# EAGLE design exp20 (EAGLE 6.5.0)
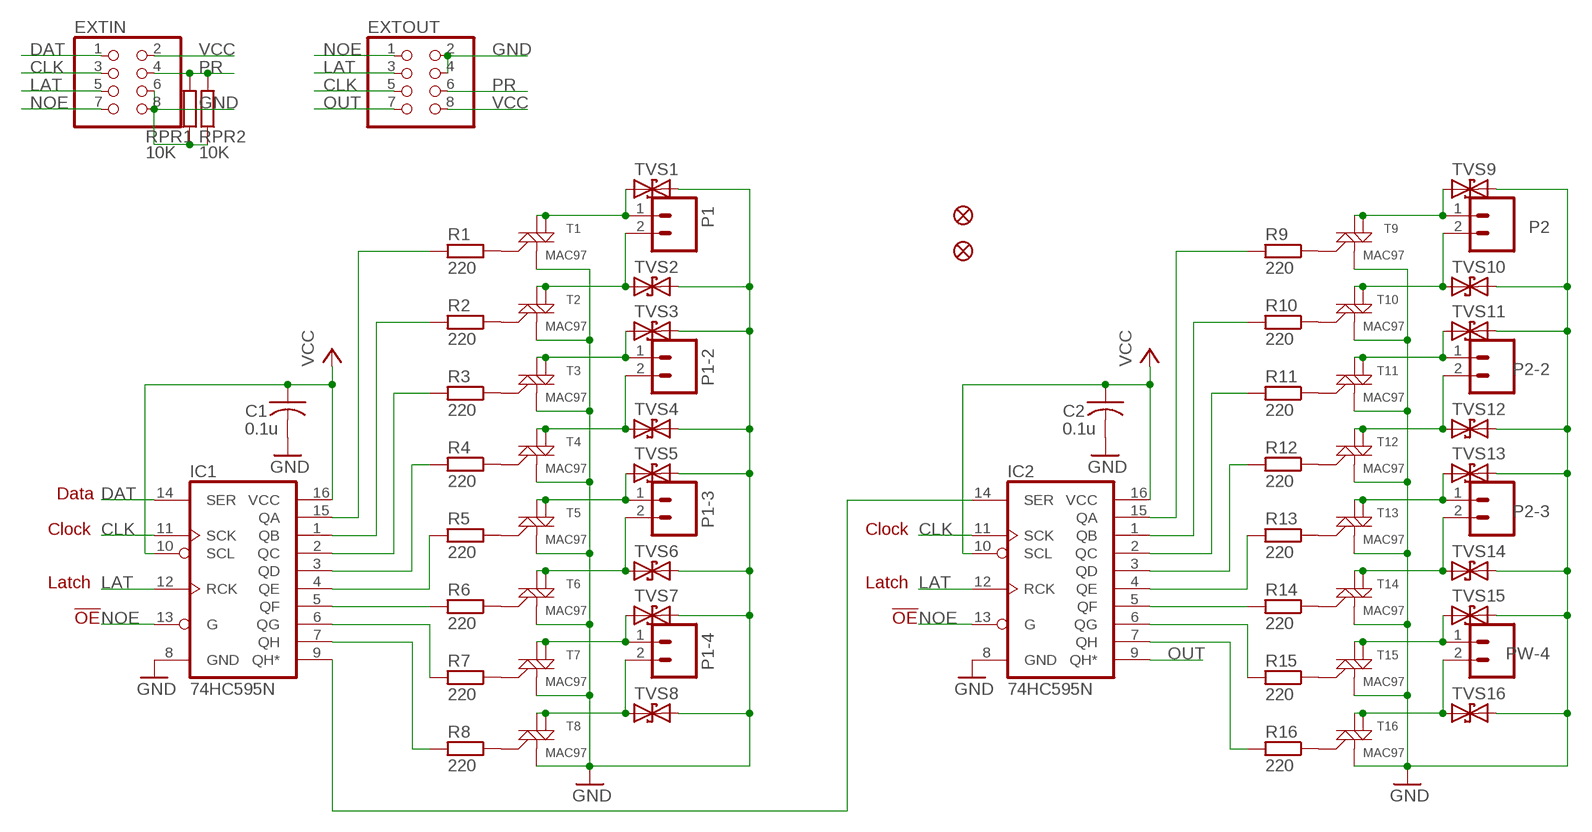
[diagram p0: schematic, sheet 1]

## Parts
C1  0.1u  C-USC0805K  [C0805K]
C2  0.1u  C-USC0805K  [C0805K]
EXTIN  PINHD-2X4/90  [2X04/90]
EXTOUT  PINHD-2X4/90  [2X04/90]
IC1  74HC595N  74LS595D  [SO16]
IC2  74HC595N  74LS595D  [SO16]
JP1  FIDUCIAL1X2  [FIDUCIAL-1X2]
JP2  FIDUCIAL1X2  [FIDUCIAL-1X2]
P1  M025MM-X  [SCREWTERMINAL-5MM-2-X]
P1-2  M025MM-X  [SCREWTERMINAL-5MM-2-X]
P1-3  M025MM-X  [SCREWTERMINAL-5MM-2-X]
P1-4  M025MM-X  [SCREWTERMINAL-5MM-2-X]
P2  M025MM-X  [SCREWTERMINAL-5MM-2-X]
P2-2  M025MM-X  [SCREWTERMINAL-5MM-2-X]
P2-3  M025MM-X  [SCREWTERMINAL-5MM-2-X]
PW-4  M025MM-X  [SCREWTERMINAL-5MM-2-X]
R1  220  R-EU_R0805  [R0805]
R2  220  R-EU_R0805  [R0805]
R3  220  R-EU_R0805  [R0805]
R4  220  R-EU_R0805  [R0805]
R5  220  R-EU_R0805  [R0805]
R6  220  R-EU_R0805  [R0805]
R7  220  R-EU_R0805  [R0805]
R8  220  R-EU_R0805  [R0805]
R9  220  R-EU_R0805  [R0805]
R10  220  R-EU_R0805  [R0805]
R11  220  R-EU_R0805  [R0805]
R12  220  R-EU_R0805  [R0805]
R13  220  R-EU_R0805  [R0805]
R14  220  R-EU_R0805  [R0805]
R15  220  R-EU_R0805  [R0805]
R16  220  R-EU_R0805  [R0805]
RPR1  10K  R-EU_R0805  [R0805]
RPR2  10K  R-EU_R0805  [R0805]
T1  MAC97  MAC97SOT223  [SOT223]
T2  MAC97  MAC97SOT223  [SOT223]
T3  MAC97  MAC97SOT223  [SOT223]
T4  MAC97  MAC97SOT223  [SOT223]
T5  MAC97  MAC97SOT223  [SOT223]
T6  MAC97  MAC97SOT223  [SOT223]
T7  MAC97  MAC97SOT223  [SOT223]
T8  MAC97  MAC97SOT223  [SOT223]
T9  MAC97  MAC97SOT223  [SOT223]
T10  MAC97  MAC97SOT223  [SOT223]
T11  MAC97  MAC97SOT223  [SOT223]
T12  MAC97  MAC97SOT223  [SOT223]
T13  MAC97  MAC97SOT223  [SOT223]
T14  MAC97  MAC97SOT223  [SOT223]
T15  MAC97  MAC97SOT223  [SOT223]
T16  MAC97  MAC97SOT223  [SOT223]
TVS1  TVSSMB  [SMB]
TVS2  TVSSMB  [SMB]
TVS3  TVSSMB  [SMB]
TVS4  TVSSMB  [SMB]
TVS5  TVSSMB  [SMB]
TVS6  TVSSMB  [SMB]
TVS7  TVSSMB  [SMB]
TVS8  TVSSMB  [SMB]
TVS9  TVSSMB  [SMB]
TVS10  TVSSMB  [SMB]
TVS11  TVSSMB  [SMB]
TVS12  TVSSMB  [SMB]
TVS13  TVSSMB  [SMB]
TVS14  TVSSMB  [SMB]
TVS15  TVSSMB  [SMB]
TVS16  TVSSMB  [SMB]

## Nets
CLK: EXTIN.3 EXTOUT.5 IC1.11(SCK) IC2.11(SCK)
DAT: EXTIN.1 IC1.14(SER)
GND [power]: C1.2 C2.2 EXTIN.6 EXTIN.8 EXTOUT.2 EXTOUT.4 IC1.8(GND) IC2.8(GND) RPR1.1 RPR2.1 T1.1(M1) T2.1(M1) T3.1(M1) T4.1(M1) T5.1(M1) T6.1(M1) T7.1(M1) T8.1(M1) T9.1(M1) T10.1(M1) T11.1(M1) T12.1(M1) T13.1(M1) T14.1(M1) T15.1(M1) T16.1(M1) TVS1.C TVS2.C TVS3.C TVS4.C TVS5.C TVS6.C TVS7.C TVS8.C TVS9.C TVS10.C TVS11.C TVS12.C TVS13.C TVS14.C TVS15.C TVS16.C
LAT: EXTIN.5 EXTOUT.3 IC1.12(RCK) IC2.12(RCK)
N$1 [power]: P1.1 T1.2(M2) T1.4(M2-4) TVS1.A
N$2 [power]: P1-2.1 T3.2(M2) T3.4(M2-4) TVS3.A
N$3 [power]: P1-3.1 T5.2(M2) T5.4(M2-4) TVS5.A
N$4: IC1.5(QF) R6.2
N$5: IC1.6(QG) R7.2
N$6 [power]: P1-4.1 T7.2(M2) T7.4(M2-4) TVS7.A
N$7: IC1.7(QH) R8.2
N$8: R1.1 T1.3(G)
N$9: R2.1 T2.3(G)
N$10: IC1.4(QE) R5.2
N$11: IC1.3(QD) R4.2
N$12: IC1.2(QC) R3.2
N$13: IC1.1(QB) R2.2
N$14: IC1.15(QA) R1.2
N$15: R3.1 T3.3(G)
N$16: R4.1 T4.3(G)
N$17 [power]: P1.2 T2.2(M2) T2.4(M2-4) TVS2.A
N$18: R5.1 T5.3(G)
N$19: R6.1 T6.3(G)
N$20 [power]: P1-2.2 T4.2(M2) T4.4(M2-4) TVS4.A
N$21: R7.1 T7.3(G)
N$22: R8.1 T8.3(G)
N$23 [power]: P1-3.2 T6.2(M2) T6.4(M2-4) TVS6.A
N$24: IC2.5(QF) R14.2
N$25 [power]: P1-4.2 T8.2(M2) T8.4(M2-4) TVS8.A
N$26: IC2.6(QG) R15.2
N$27: IC2.7(QH) R16.2
N$28: IC2.4(QE) R13.2
N$29: IC2.3(QD) R12.2
N$30: IC2.2(QC) R11.2
N$31: IC2.1(QB) R10.2
N$32: IC2.15(QA) R9.2
N$33 [power]: P2.2 T10.2(M2) T10.4(M2-4) TVS10.A
N$34 [power]: P2-2.2 T12.2(M2) T12.4(M2-4) TVS12.A
N$35 [power]: P2-3.2 T14.2(M2) T14.4(M2-4) TVS14.A
N$36 [power]: PW-4.2 T16.2(M2) T16.4(M2-4) TVS16.A
N$37 [power]: P2.1 T9.2(M2) T9.4(M2-4) TVS9.A
N$38: P2-2.1 T11.2(M2) T11.4(M2-4) TVS11.A
N$39: P2-3.1 T13.2(M2) T13.4(M2-4) TVS13.A
N$40: PW-4.1 T15.2(M2) T15.4(M2-4) TVS15.A
N$41: R9.1 T9.3(G)
N$42: R10.1 T10.3(G)
N$43: R11.1 T11.3(G)
N$44: R12.1 T12.3(G)
N$45: R13.1 T13.3(G)
N$46: R14.1 T14.3(G)
N$47: R15.1 T15.3(G)
N$48: R16.1 T16.3(G)
N$49: IC1.9(QH*) IC2.14(SER)
NOE: EXTIN.7 EXTOUT.1 IC1.13(G) IC2.13(G)
OUT: EXTOUT.7 IC2.9(QH*)
PR: EXTIN.4 EXTOUT.6 RPR1.2 RPR2.2
VCC: C1.1 C2.1 EXTIN.2 EXTOUT.8 IC1.10(SCL) IC1.16(VCC) IC2.10(SCL) IC2.16(VCC)

## Notes on the sheet
- Data
- Clock | Clock
- Latch | Latch
- !OE | !OE

## Library data of the parts
C1 C2 = adafruit2013:C-US: CAPACITOR, American symbol
EXTIN EXTOUT = pinhead:PINHD-2X4: PIN HEADER
IC1 IC2 = SparkFun:74*595: 8-bit SHIFT REGISTER, output latch
JP1 JP2 = SparkFun:FIDUCIAL: Fiducial Alignment Points Various fiducial points for machine vision alignment.
P1 P1-2-P1-4 P2 P2-2 P2-3 PW-4 = SparkFun:M02: Header 2 Standard 2-pin 0.1" header. Use with straight break away headers (SKU : PRT-00116), right angle break away headers (PRT-00553), swiss pins (PRT-00743), machine pins (PRT-00117), and female headers (PRT-00115). Molex polarized connector foot print use with SKU : PRT-08233 with associated crimp pins and housings.
R1-R16 RPR1 RPR2 = rcl:R-EU_: RESISTOR, European symbol
T1-T16 = SparkFun:MAC97: MAC97 Triac http://www.onsemi.com/pub_link/Collateral/MAC97-D.PDF
TVS1-TVS16 = SparkFunNew:TVS

## Net classes
0 default: width 0.254 mm, clearance 0.203 mm
1 power: width 0.508 mm, clearance 0.203 mm

## Board
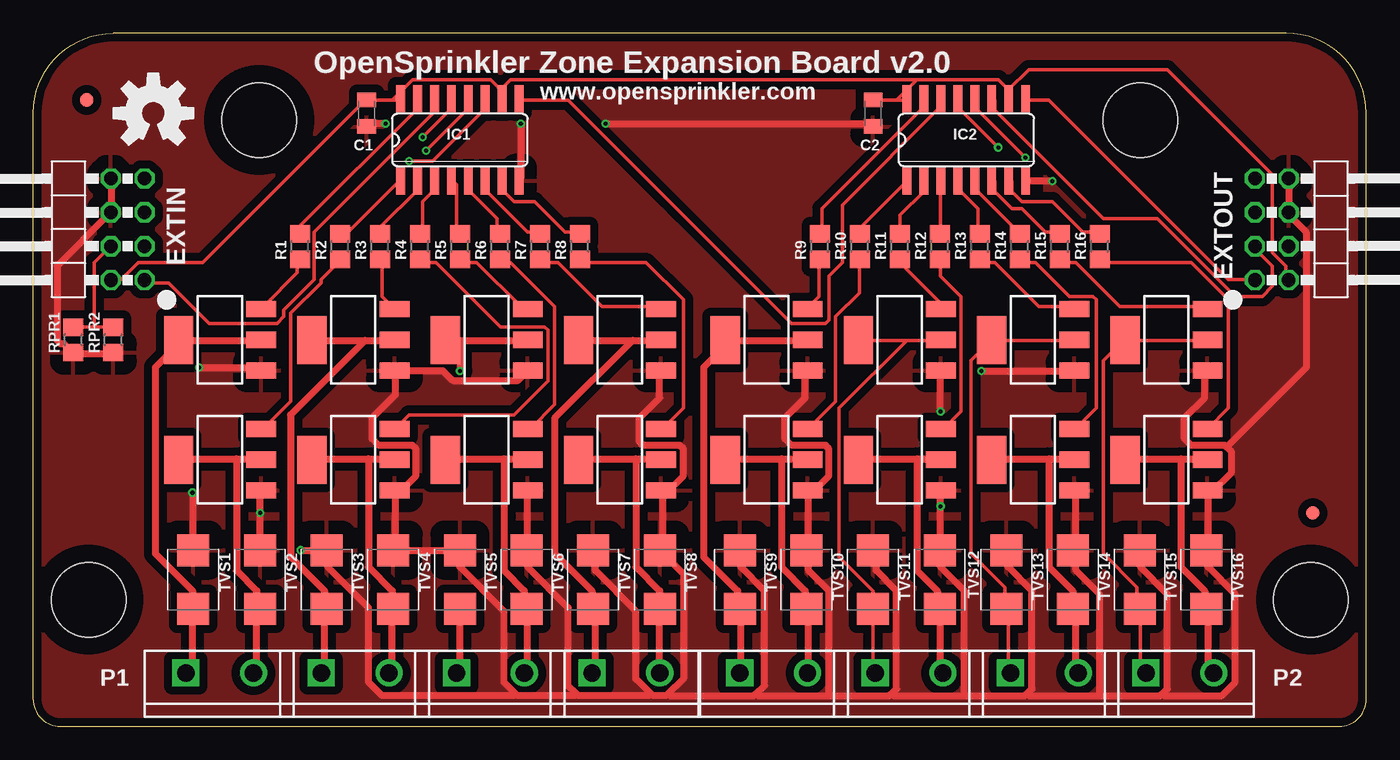
[diagram p1: board, top side]
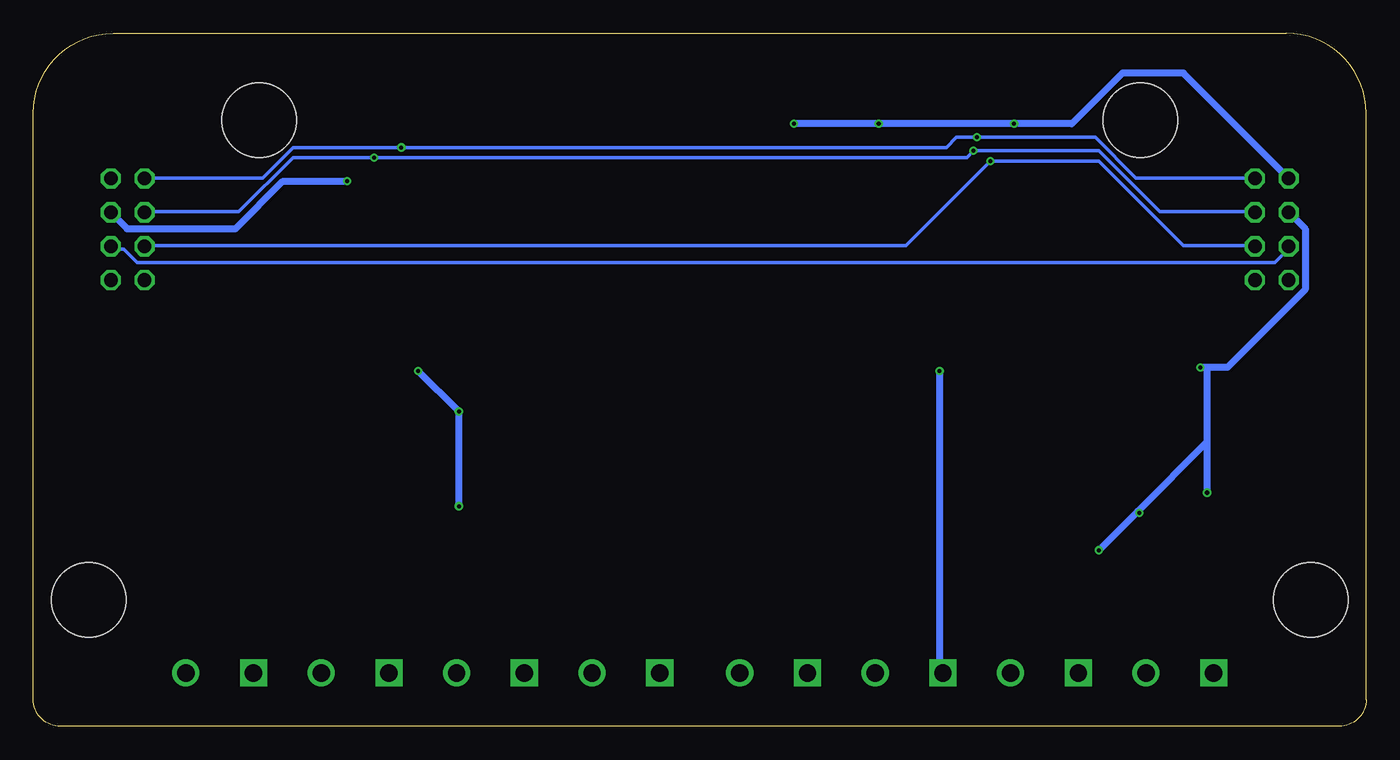
[diagram p2: board, bottom side, seen from below]

Size 100 x 52 mm. Coordinates in mm from the lower left corner, seen from the top.
Outline: 2,0 98,0 arc90 100,2 100,46 arc90 94,52 6,52 arc90 0,46 0,2 arc90 2,0
Copper layers (1*16): Top 0.035mm / dielectric 1.5mm / Bottom 0.035mm
Design rules "Fusion_eagle_rule_v1.1 *": minimum track width 6mil, minimum drill 12mil, track to track 6mil, track to pad 6mil, pad to pad 6mil, via to via 6mil, smd to smd 0mil, copper to edge 10mil, drill to drill 10mil, minimum pad ring 10mil, minimum via ring 6mil, stop-mask expansion 2mil, vias tented up to drill 100mil, thermal gap 40mil
Holes 5.6 mm at 4.14,9.49 95.86,9.49 16.95,45.49 83.06,45.49
tRestrict: area 0.6,6 to 7.6,13; area 92.4,6 to 99.4,13; area 13.4,42 to 20.4,49; area 79.6,42 to 86.6,49
vRestrict: area 21,47 to 78,51

### Footprints (pad centres in the part's own frame; a part is rotated, then mirrored left to right if it is on the bottom)
C0805K = smd 1.1 x 1.4: 1 -1,0; 2 1,0
2X04/90 = drill 1.016 octagon: 1 -3.81,-6.35; 2 -3.81,-3.81; 3 -1.27,-6.35; 4 -1.27,-3.81; 5 1.27,-6.35; 6 1.27,-3.81; 7 3.81,-6.35; 8 3.81,-3.81
SO16 = smd 0.66 x 2.032: 1 -4.445,-3.073; 2 -3.175,-3.073; 3 -1.905,-3.073; 4 -0.635,-3.073; 5 0.635,-3.073; 6 1.905,-3.073; 7 3.175,-3.073; 8 4.445,-3.073; 9 4.445,3.073; 10 3.175,3.073; 11 1.905,3.073; 12 0.635,3.073; 13 -0.635,3.073; 14 -1.905,3.073; 15 -3.175,3.073; 16 -4.445,3.073
FIDUCIAL-1X2 = smd 1 x 1: 1 0,0
SCREWTERMINAL-5MM-2-X = drill 1.3 pad 2.032 square: 1 0,0 | drill 1.3 pad 2.032: 2 5.08,0
R0805 = smd 1.3 x 1.5: 1 -0.95,0; 2 0.95,0
SOT223 = smd 1.219 x 2.235: 1 -2.311,-3.099; 2 0,-3.099; 3 2.311,-3.099 | smd 3.6 x 2.2: 4 0,3.099
SMB = smd 2.4 x 2.4: A 2.2,0; C -2.2,0

### Placement (x,y rotation side)
C1  25,46 270 top
C2  63,46 270 top
EXTIN  2,37.29 90 top
EXTOUT  98,37.29 270 top
IC1  32,44 0 top
IC2  70,44 0 top
JP1  4,47 0 top
JP2  96,16 0 top
P1  11.44,4 0 top
P1-2  21.6,4 0 top
P1-3  31.76,4 0 top
P1-4  41.92,4 0 top
P2  53,4 0 top
P2-2  63.16,4 0 top
P2-3  73.32,4 0 top
PW-4  83.48,4 0 top
R1  20,36 90 top
R2  23,36 90 top
R3  26,36 90 top
R4  29,36 90 top
R5  32,36 90 top
R6  35,36 90 top
R7  38,36 90 top
R8  41,36 90 top
R9  59,36 90 top
R10  62,36 90 top
R11  65,36 90 top
R12  68,36 90 top
R13  71,36 90 top
R14  74,36 90 top
R15  77,36 90 top
R16  80,36 90 top
RPR1  3,29 90 top
RPR2  6,29 90 top
T1  14,29 90 top
T2  14,20 90 top
T3  24,29 90 top
T4  24,20 90 top
T5  34,29 90 top
T6  34,20 90 top
T7  44,29 90 top
T8  44,20 90 top
T9  55,29 90 top
T10  55,20 90 top
T11  65,29 90 top
T12  65,20 90 top
T13  75,29 90 top
T14  75,20 90 top
T15  85,29 90 top
T16  85,20 90 top
TVS1  12,11 270 top
TVS2  17,11 270 top
TVS3  22,11 270 top
TVS4  27,11 270 top
TVS5  32,11 270 top
TVS6  37,11 270 top
TVS7  42,11 270 top
TVS8  47,11 270 top
TVS9  53,11 270 top
TVS10  58,11 270 top
TVS11  63,11 270 top
TVS12  68,11 270 top
TVS13  73,11 270 top
TVS14  78,11 270 top
TVS15  83,11 270 top
TVS16  88,11 270 top

### Tracks (layer width: path | path; a pad name or v marks a point on that pad's centre or on a via)
CLK  (via drill 0.3)
  Top 0.254: IC2.11 72.14,46.99 72.14,46.23 80.26,38.1 84.33,38.1 90.17,32.26 92.2,32.26 92.96,33.02 92.96,34.54 91.69,35.81 EXTOUT.5 | v28.19,42.42 29.97,42.42 33.78,46.23 33.78,46.99 IC1.11
  Bottom 0.254: EXTIN.3 8.38,36.07 13.72,36.07 20.07,42.42 v28.19,42.42 34.54,36.07 91.44,36.07 EXTOUT.5
DAT
  Top 0.254: IC1.14 29.97,46.99 29.97,45.97 21.08,37.08 21.08,33.53 18.8,31.24 18.8,30.73 18.29,30.23 13.21,30.23 10.16,33.27 8.38,33.27 EXTIN.1
GND  (via drill 0.3)
  Top 0.508: T2.1 17.02,17.53 v17.02,16 17.02,13.21 TVS2.C | RPR2.1 5.84,27.94 3.05,27.94 RPR1.1 2.79,28.19 2.29,28.7 2.03,28.7 1.78,28.96 1.78,34.54 5.59,38.35 EXTIN.6 5.84,38.61 5.84,40.89 EXTIN.8 | v12.45,26.92 17.02,26.92 T1.1 | v11.94,17.53 11.94,13.21 TVS1.C | v20.07,13.21 21.84,13.21 TVS3.C 22.1,12.95 22.1,11.94 25.15,8.89 25.15,3.3 26.16,2.29 36.07,2.29 36.2,2.41 | v26.42,45.21 25.15,45.21 C1.2 | v42.93,45.21 62.99,45.21 C2.2 | v36.58,45.21 36.58,41.15 IC1.8 | 89.53,20.95 89.92,20.57 89.92,19.05 88.39,17.53 T16.1 88.14,17.53 88.14,13.21 TVS16.C 88.14,12.95 88.14,11.94 90.17,9.91 90.17,3.3 89.15,2.29 84.84,2.29 84.71,2.41 | 89.53,20.95 89.41,21.08 86.87,21.08 86.36,21.59 86.36,23.11 87.88,24.64 87.88,26.67 T15.1 | 74.42,41.15 IC2.8 74.68,40.89 v76.45,40.89 | EXTOUT.2 94.23,40.89 94.23,38.61 EXTOUT.4 94.23,38.35 95.5,37.08 95.5,26.92 89.53,20.95 | T12.1 68.07,17.53 v68.07,16.51 68.07,13.21 TVS12.C 68.07,12.95 68.07,11.94 69.85,10.16 69.85,2.29 | v68.07,23.62 68.07,26.67 T11.1 | v71.12,26.67 77.98,26.67 T13.1 | T9.1 57.91,26.67 57.91,24.64 56.39,23.11 56.39,21.59 56.9,21.08 59.44,21.08 59.69,20.83 59.69,18.8 58.42,17.53 T10.1 58.17,17.53 58.17,13.21 TVS10.C 58.17,12.95 58.17,11.68 59.69,10.16 59.69,2.29 | T5.1 37.08,26.67 36.32,25.91 31.5,25.91 30.73,26.67 27.18,26.67 T3.1 27.18,26.42 27.18,24.89 25.4,23.11 25.4,21.59 25.91,21.08 28.45,21.08 28.7,20.83 28.7,18.8 27.43,17.53 T4.1 27.18,17.53 27.18,13.21 TVS4.C 27.43,13.21 31.75,13.21 TVS5.C 32,12.95 32,11.94 35.31,8.64 35.31,3.3 36.2,2.41 | T14.1 78.23,17.53 78.23,13.21 TVS14.C 78.23,12.95 78.23,11.68 80.01,9.91 80.01,2.29
  Top 0.508: T6.1 37.08,17.53 37.08,13.21 TVS6.C 37.08,12.95 37.08,11.94 40.13,8.89 40.13,3.05 40.77,2.41 | T7.1 46.99,26.67 46.99,24.64 45.47,23.11 45.47,21.34 45.72,21.08 48.51,21.08 48.77,20.83 48.77,18.8 47.5,17.53 T8.1 47.24,17.53 47.24,13.21 TVS8.C 47.24,12.95 48.77,11.43 48.77,3.56 47.62,2.41 | 46.35,2.41 46.48,2.29 47.5,2.29 47.62,2.41 | 46.35,2.41 45.21,3.56 45.21,8.64 42.16,11.68 42.16,12.95 TVS7.C | 54.23,2.41 54.1,2.29 47.75,2.29 47.62,2.41 | 54.23,2.41 54.86,3.05 54.86,10.16 53.09,11.94 53.09,12.95 TVS9.C | 64.39,2.41 64.26,2.29 59.69,2.29 | 64.39,2.41 64.77,2.79 64.77,10.16 63.25,11.68 63.25,12.95 TVS11.C | 59.69,2.29 54.36,2.29 54.23,2.41 | 74.55,2.41 74.42,2.29 69.85,2.29 | 74.55,2.41 74.93,2.79 74.93,10.16 73.15,11.94 73.15,12.95 TVS13.C | 69.85,2.29 64.52,2.29 64.39,2.41 | 84.71,2.41 84.58,2.29 80.01,2.29 | 84.71,2.41 85.09,2.79 85.09,9.91 83.06,11.94 83.06,12.95 TVS15.C | 80.01,2.29 74.68,2.29 74.55,2.41 | 40.77,2.41 40.89,2.29 46.23,2.29 46.35,2.41 | 36.2,2.41 36.32,2.29 40.64,2.29 40.77,2.41
  Bottom 0.508: 11.94,26.92 10.41,26.92 4.57,32.77 4.57,37.34 5.59,38.35 EXTIN.6 | 11.94,26.92 v12.45,26.92 | 11.94,26.92 11.94,21.34 | 11.94,21.34 v11.94,17.53 | 11.94,21.34 17.14,16.13 | 17.14,16.13 v20.07,13.21 | v17.02,16 17.14,16.13 | EXTIN.8 5.84,41.15 13.72,49.02 18.29,49.02 22.1,45.21 v26.42,45.21 v36.58,45.21 v42.93,45.21 | v76.45,40.89 81.28,40.89 84.84,37.34 92.96,37.34 93.98,38.35 EXTOUT.4 | v68.07,16.51 v68.07,23.62 v71.12,26.67
  pour Top (isolate 0.61): 0,55 100,55 100,0 0,0
LAT  (via drill 0.3)
  Top 0.254: v74.42,42.67 70.87,46.23 70.87,46.99 IC2.12 | v29.46,43.18 32.51,46.23 32.51,46.99 IC1.12
  Bottom 0.254: EXTOUT.3 91.44,38.61 84.58,38.61 80.52,42.67 v74.42,42.67 29.97,42.67 v29.46,43.18 20.07,43.18 15.49,38.61 8.38,38.61 EXTIN.5
N$1
  Top 0.508: P1.1 11.68,4.06 11.94,4.32 11.94,8.64 TVS1.A 11.94,8.89 11.94,10.16 9.14,12.95 9.14,26.92 10.92,28.7 T1.4 10.92,28.96 17.02,28.96 T1.2
N$2
  Top 0.508: P1-2.1 21.84,4.06 21.84,8.64 TVS3.A 21.84,8.89 21.84,10.16 19.3,12.7 19.3,23.37 24.89,28.96 | 24.89,28.96 21.08,28.96 T3.4 | 24.89,28.96 26.92,28.96 T3.2
N$3  (via drill 0.3)
  Top 0.508: TVS5.A 32,8.64 32,4.06 P1-3.1 | 32,28.96 30.99,28.96 T5.4 | 32,28.96 37.08,28.96 T5.2 | 32,28.96 v32,26.67
  Bottom 0.508: v32,26.67 32,4.06 P1-3.1
N$4
  Top 0.254: R6.2 34.8,37.08 34.8,38.1 32.77,40.13 32.77,40.89 IC1.5
N$5
  Top 0.254: R7.2 37.85,37.08 37.08,37.08 34.04,40.13 34.04,40.89 IC1.6
N$6
  Top 0.508: P1-4.1 42.16,4.06 42.16,8.64 TVS7.A 41.91,8.89 41.91,10.16 39.12,12.95 39.12,23.11 44.96,28.96 | 44.96,28.96 41.15,28.96 T7.4 | 44.96,28.96 46.99,28.96 T7.2
N$7
  Top 0.254: R8.2 40.89,37.08 39.88,37.08 37.59,39.37 36.07,39.37 35.31,40.13 35.31,40.89 IC1.7
N$8
  Top 0.254: R1.1 19.81,34.8 19.81,34.04 17.27,31.5 T1.3
N$9
  Top 0.254: R2.1 22.86,34.8 21.59,33.53 21.59,33.27 19.3,30.99 19.3,24.38 17.27,22.35 T2.3
N$10
  Top 0.254: R5.2 31.75,37.08 31.75,40.64 31.5,40.89 IC1.4
N$11
  Top 0.254: R4.2 29.21,37.08 29.21,39.37 29.97,40.13 29.97,40.89 IC1.3
N$12
  Top 0.254: R3.2 26.16,37.08 26.16,37.59 28.7,40.13 28.7,40.89 IC1.2
N$13
  Top 0.254: R2.2 23.11,37.08 23.62,37.08 27.43,40.89 IC1.1
N$14
  Top 0.254: R1.2 20.07,37.08 20.07,37.59 28.7,46.23 28.7,46.99 IC1.15
N$15
  Top 0.254: R3.1 26.16,34.8 26.16,32.26 26.92,31.5 T3.3
N$16
  Top 0.254: R4.1 29.21,34.8 30.23,34.8 35.05,29.97 38.35,29.97 38.61,29.72 38.61,25.91 36.07,23.37 28.19,23.37 27.18,22.35 T4.3
N$17
  Top 0.508: P1.2 16.76,4.06 16.76,8.64 TVS2.A 16.76,8.89 16.76,10.16 15.24,11.68 15.24,20.07 | 15.24,20.07 10.92,20.07 T2.4 | 15.24,20.07 17.02,20.07 T2.2
N$18
  Top 0.254: R5.1 32,34.8 33.27,34.8 36.58,31.5 37.08,31.5 T5.3
N$19
  Top 0.254: R6.1 35.05,34.8 35.81,34.8 39.12,31.5 39.12,24.13 37.34,22.35 T6.3
N$20
  Top 0.508: P1-2.2 26.92,4.06 26.92,8.64 TVS4.A 26.92,8.89 26.92,10.16 25.15,11.94 25.15,20.07 | 25.15,20.07 21.08,20.07 T4.4 | 25.15,20.07 26.92,20.07 T4.2
N$21
  Top 0.254: R7.1 38.1,34.8 39.37,34.8 42.67,31.5 46.99,31.5 T7.3
N$22
  Top 0.254: R8.1 41.15,34.8 45.97,34.8 48.77,32 48.77,23.88 47.24,22.35 T8.3
N$23
  Top 0.508: P1-3.2 37.08,4.06 37.08,8.64 TVS6.A 36.83,8.89 36.83,10.16 35.31,11.68 35.31,20.07 | 35.31,20.07 30.99,20.07 T6.4 | 35.31,20.07 37.08,20.07 T6.2
N$24
  Top 0.254: R14.2 73.91,37.08 70.87,40.13 70.87,40.89 IC2.5
N$25
  Top 0.508: P1-4.2 46.99,4.06 46.99,8.64 TVS8.A 46.99,8.89 46.99,10.16 45.21,11.94 45.21,20.07 | 45.21,20.07 41.15,20.07 T8.4 | 45.21,20.07 46.99,20.07 T8.2
N$26
  Top 0.254: R15.2 76.96,37.08 75.95,37.08 74.17,38.86 73.41,38.86 72.14,40.13 72.14,40.89 IC2.6
N$27
  Top 0.254: R16.2 79.76,37.08 78.74,37.08 76.45,39.37 74.17,39.37 73.41,40.13 73.41,40.89 IC2.7
N$28
  Top 0.254: R13.2 70.87,37.08 70.87,38.86 69.6,40.13 69.6,40.89 IC2.4
N$29
  Top 0.254: R12.2 68.07,37.08 68.07,40.89 IC2.3
N$30
  Top 0.254: R11.2 65.02,37.08 65.02,38.35 66.8,40.13 66.8,40.89 IC2.2
N$31
  Top 0.254: R10.2 62.23,37.08 62.23,37.59 65.53,40.89 IC2.1
N$32
  Top 0.254: R9.2 59.18,37.08 59.18,38.86 66.8,46.48 66.8,46.99 IC2.15
N$33
  Top 0.508: P2.2 58.17,4.06 58.17,8.64 TVS10.A 57.91,8.89 57.91,10.16 56.13,11.94 56.13,20.07 | 56.13,20.07 52.07,20.07 T10.4 | 56.13,20.07 57.91,20.07 T10.2
N$34
  Top 0.508: P2-2.2 68.07,4.06 68.07,8.64 TVS12.A 67.82,8.89 67.82,10.16 66.29,11.68 66.29,20.07 | 66.29,20.07 61.98,20.07 T12.4 | 66.29,20.07 68.07,20.07 T12.2
N$35
  Top 0.508: P2-3.2 78.23,4.06 78.23,8.64 TVS14.A 77.98,8.89 77.98,10.16 76.2,11.94 76.2,20.07 | 76.2,20.07 72.14,20.07 T14.4 | 76.2,20.07 77.98,20.07 T14.2
N$36
  Top 0.508: PW-4.2 88.39,4.06 88.14,4.32 88.14,8.64 TVS16.A 87.88,8.89 87.88,10.16 86.11,11.94 86.11,20.07 | 86.11,20.07 82.04,20.07 T16.4 | 86.11,20.07 87.88,20.07 T16.2
N$37
  Top 0.508: P2.1 53.09,4.06 53.09,8.64 TVS9.A 52.83,8.89 52.83,10.16 50.29,12.7 50.29,26.92 52.07,28.7 T9.4 52.07,28.96 57.91,28.96 T9.2
N$38
  Top 0.254: P2-2.1 62.99,4.06 62.99,8.64 TVS11.A 62.99,8.89 62.99,10.16 60.45,12.7 60.45,23.88 65.53,28.96 | 65.53,28.96 61.98,28.96 T11.4 | 65.53,28.96 68.07,28.96 T11.2
N$39
  Top 0.254: P2-3.1 73.15,4.06 73.15,8.64 TVS13.A 72.9,8.89 72.9,10.41 70.36,12.95 70.36,27.43 71.88,28.96 T13.4 72.14,28.96 77.98,28.96 T13.2
N$40
  Top 0.254: PW-4.1 83.31,4.06 83.06,4.32 83.06,8.64 TVS15.A 82.8,8.89 82.8,10.41 80.26,12.95 80.26,27.43 81.79,28.96 T15.4 82.04,28.96 87.88,28.96 T15.2
N$41
  Top 0.254: R9.1 58.93,34.8 58.93,32.26 58.17,31.5 T9.3
N$42
  Top 0.254: R10.1 61.98,34.8 61.98,32.51 60.2,30.73 60.2,24.38 58.17,22.35 T10.3
N$43
  Top 0.254: R11.1 65.02,34.8 68.33,31.5 T11.3
N$44
  Top 0.254: R12.1 68.07,34.8 68.07,33.78 69.6,32.26 69.6,23.62 68.33,22.35 T12.3
N$45
  Top 0.254: R13.1 71.12,34.8 72.14,34.8 75.44,31.5 77.98,31.5 T13.3
N$46
  Top 0.254: R14.1 74.17,34.8 75.18,34.8 77.72,32.26 79.5,32.26 79.76,32 79.76,23.88 78.23,22.35 T14.3
N$47
  Top 0.254: R15.1 77.22,34.8 78.23,34.8 81.53,31.5 87.88,31.5 T15.3
N$48
  Top 0.254: R16.1 80.01,34.8 86.87,34.8 89.66,32 89.66,23.88 88.14,22.35 T16.3
N$49
  Top 0.254: IC1.9 36.58,46.99 40.13,46.99 56.9,30.23 59.44,30.23 59.69,30.48 59.69,33.78 60.71,34.8 60.71,39.12 68.07,46.48 68.07,46.99 IC2.14
NOE  (via drill 0.3)
  Top 0.254: v72.39,43.43 69.6,46.23 69.6,46.99 IC2.13 | v29.21,44.2 31.24,46.23 31.24,46.99 IC1.13
  Bottom 0.254: EXTOUT.1 91.44,41.15 82.8,41.15 80.52,43.43 v72.39,43.43 31.5,43.43 30.73,44.2 v29.21,44.2 20.32,44.2 17.27,41.15 8.38,41.15 EXTIN.7
OUT
  Top 0.254: IC2.9 74.68,46.99 76.2,46.99 89.66,33.53 91.44,33.53 EXTOUT.7
PR
  Top 0.254: 4.57,29.97 5.84,29.97 RPR2.2 | 4.57,29.97 3.05,29.97 RPR1.2 | 4.57,29.97 4.57,34.8 5.59,35.81 EXTIN.4
  Bottom 0.254: EXTOUT.6 93.98,35.81 93.22,35.81 92.2,34.8 6.86,34.8 5.84,35.81 EXTIN.4
VCC
  Top 0.254: 26.92,46.99 27.43,46.99 IC1.16 | 26.92,46.99 25.15,46.99 C1.1 24.89,46.99 12.7,34.8 7.87,34.8 6.6,33.53 5.84,33.53 EXTIN.2 | 35.05,47.75 35.05,47.24 IC1.10 35.05,47.75 | 35.05,47.75 34.29,48.51 28.45,48.51 26.92,46.99 | 64.77,46.99 65.53,46.99 IC2.16 65.53,47.24 | 64.77,46.99 63.25,46.99 C2.1 | 73.15,47.75 73.15,47.24 IC2.10 73.15,47.75 | 73.15,47.75 72.39,48.51 66.29,48.51 | 64.77,46.99 66.29,48.51 | 73.15,47.75 74.68,49.28 85.09,49.28 92.96,41.4 92.96,35.56 93.98,34.54 93.98,33.53 EXTOUT.8 | 35.05,47.75 35.81,48.51 66.29,48.51

### Text on the board
tNames: OpenSprinkler Zone Expansion Board v2.0 | www.opensprinkler.com | P1 | P2
BoxDim: Serpac WM-011 Enclosure | All units are in inch